# EAGLE schematic WS2801_LED_Cascade (EAGLE 6.5.0)
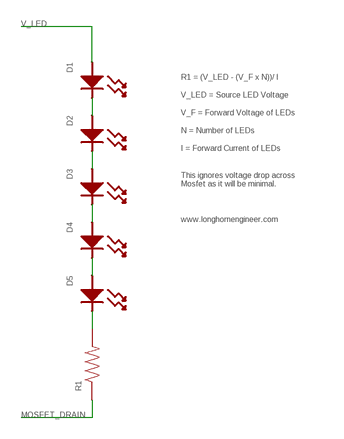
[diagram p0: schematic, sheet 1]

## Parts
D1  LED_SINGLE0402  [LED_0402]
D2  LED_SINGLE0402  [LED_0402]
D3  LED_SINGLE0402  [LED_0402]
D4  LED_SINGLE0402  [LED_0402]
D5  LED_SINGLE0402  [LED_0402]
R1  RESISTOR0402  [0402]

## Nets
MOSFET_DRAIN: R1.1
N$1: D1.CATHODE D2.ANODE
N$2: D2.CATHODE D3.ANODE
N$3: D3.CATHODE D4.ANODE
N$4: D4.CATHODE D5.ANODE
N$5: D5.CATHODE R1.2
V_LED: D1.ANODE

## Notes on the sheet
- R1 = (V_LED - (V_F x N))/ I
- V_LED = Source LED Voltage
- V_F = Forward Voltage of LEDs
- N = Number of LEDs
- I = Forward Current of LEDs
- This ignores voltage drop across
  Mosfet as it will be minimal.
- www.longhornengineer.com

## Library data of the parts
D1-D5 = PP_LED:LED_SINGLE
R1 = PP_Passives:RESISTOR: Resistors